# Altium schematic sheet Main.SchDoc
size A; SheetNumber: 1; SheetTotal: 1
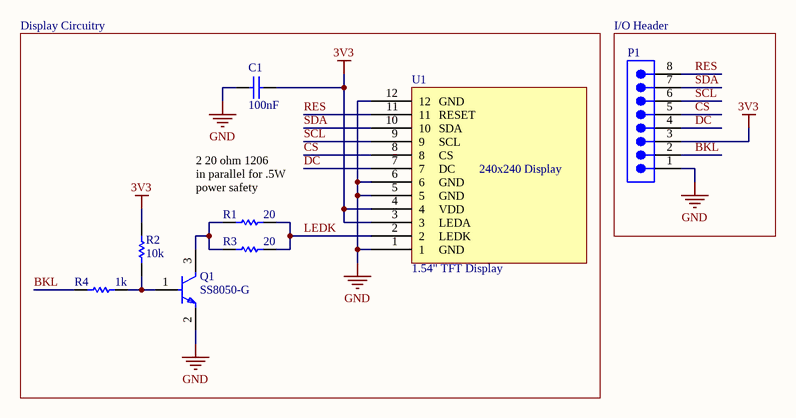
[diagram p0: Main.SchDoc]

## Parts
C1  100nF  [CAPC1608X87X35NL15T15]
P1  61300811121  [61300811121]  (value not drawn)
Q1  SS8050-G  [FP-SS8050-G-MFG]
R1  20  [RESC3116X65X40NL10T20]
R2  10k  [RESC1608X55X25NL10T15]
R3  20  [RESC3116X65X40NL10T20]
R4  1k  [RESC1608X55X25NL10T15]
U1  1.54" TFT Display  [PCBComponent_1]

## Blocks framed on the sheet
I/O Header: P1

## Nets
3V3: C1.1 P1.3 R2.2 U1.3 U1.4
GND: C1.2 P1.1 Q1.2(E) U1.1 U1.5 U1.6 U1.12
BKL: P1.2 R4.1
CS: P1.5 U1.8
DC: P1.4 U1.7
LEDK: R1.2 R3.2 U1.2
RES: P1.8 U1.11
SCL: P1.6 U1.9
SDA: P1.7 U1.10
NetQ1_1: Q1.1(B) R2.1 R4.2
NetQ1_3: Q1.3(C) R1.1 R3.1

## Notes on the sheet
- Display Circuitry
- 2 20 ohm 1206
- (near R1) in parallel for .5W
- (near R1) power safety
- (in symbol 1.54" TFT Display) GND; RESET; SDA; SCL; CS; DC; 240x240 Display; VDD; LEDA; LEDK

## Library data of the parts
C1 = CMP-2006-03301-1
P1 = CMP-1502-01076-4: THT Vertical Pin Header WR-PHD, Pitch 2.54 mm, Single Row, 8 pins; Pitch: 2.54mm; Voltage Rating: 250V; Connector Type: Male Pin; Current Rating: 3A; Contact Resistance: 20mΩ; Number of Positions: 8; Gender: Male; Contact Mating Length: 5.9944mm; Orientation: Vertical; Contact Plating: Gold; Mount: Through Hole; Min Operating Temperature: -40°C; Packaging: Bulk; Height: 8.54mm; Number of Pins: 8; Contact Material: Gold; Operating Supply Voltage: 250V; Termination: Solder; RoHS: Compliant; Color: Black; Number of Contacts: 8; Lead Pitch: 2.54mm; Number of Rows: 1; Max Operating Temperature: 105°C
Q1 = CMP-20235-000001-1: NPN TRANSISTOR 1.5A 40V SOT-23 R; Transition Frequency: 100MHz; Max Breakdown Voltage: 25V; Collector Emitter Voltage (VCEO): 400mV; Max Power Dissipation: 300mW; Max Collector Current: 1.5A; Case/Package: TO-236-3; Packaging: Tape and Reel; RoHS Compliant: Yes; Mount: Surface Mount; Collector Emitter Breakdown Voltage: 25V
R1 R3 = CMP-2003-03957-1: Manufacturer: Yageo; Part Number: RC1206JR-0720RL
R2 R4 = CMP-2000-04525-1: Part Number: RT0603BRE071KL; Manufacturer: Yageo